# EAGLE design asynclabs_blackwidow_v1 (EAGLE 5.06)
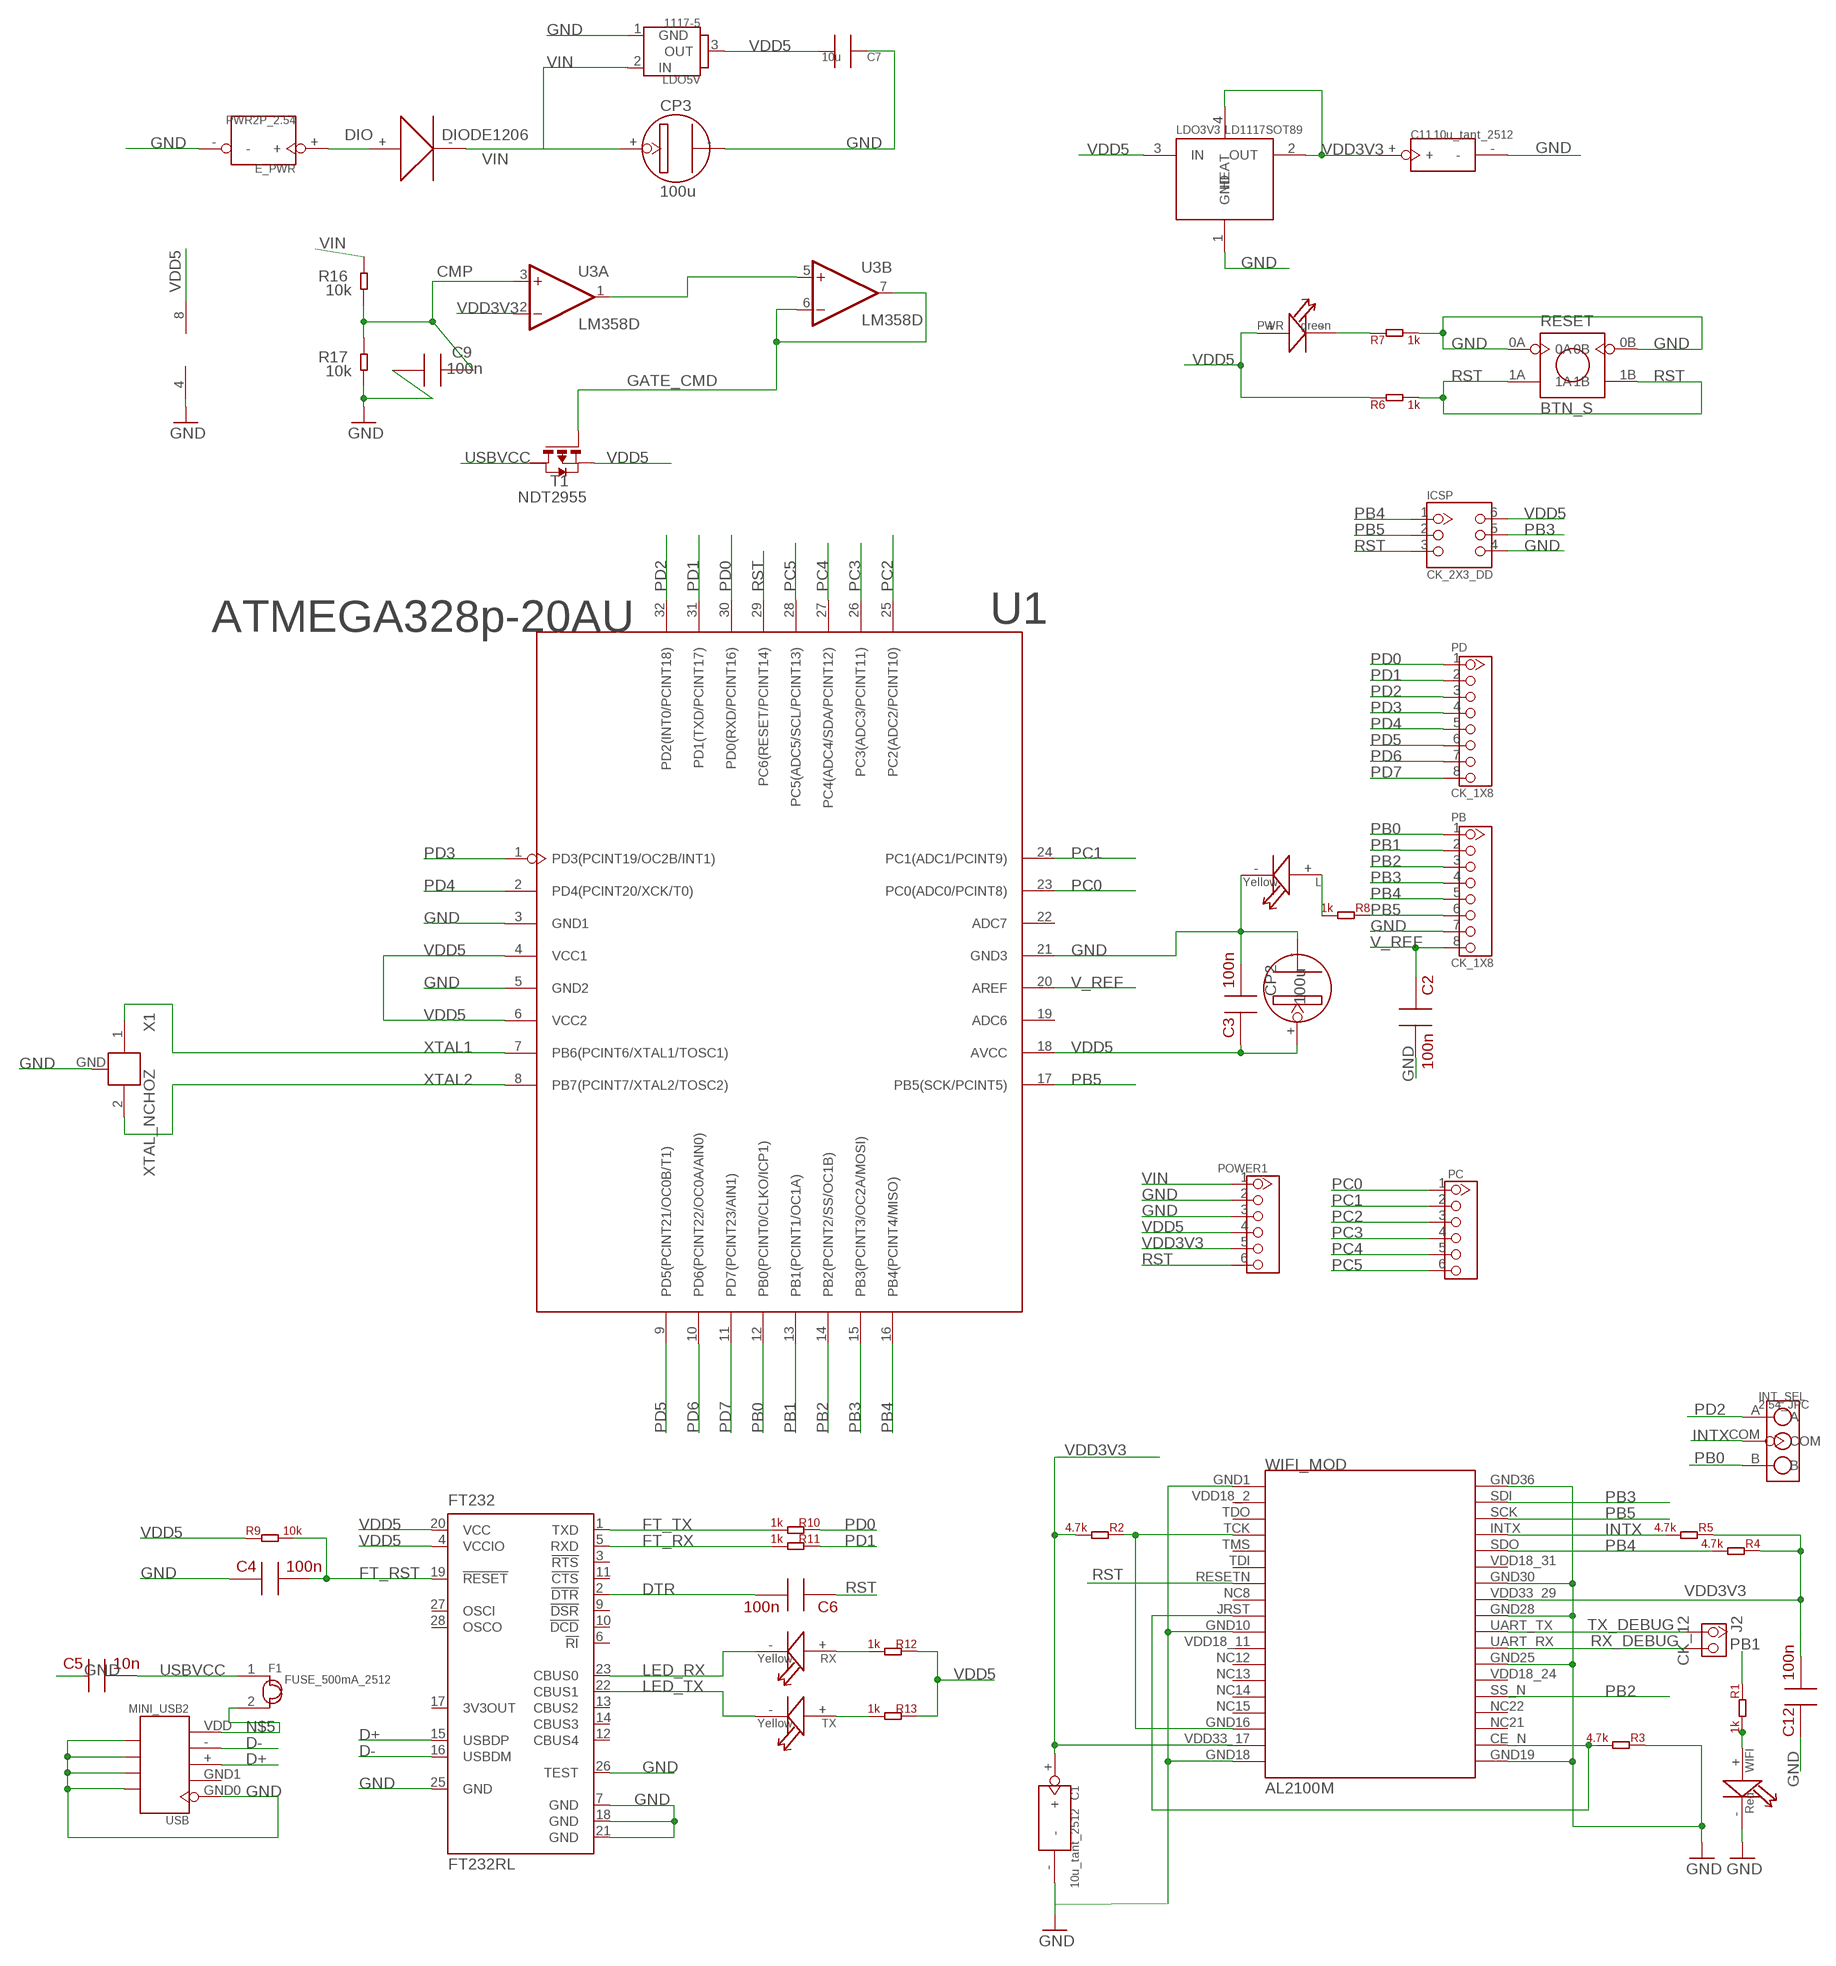
[diagram p0: schematic, sheet 1]

## Parts
C1  10u_tant_2512  C_TAN_3X3.5  [C_TAN_3X3.5]
C2  100n  C0603  [0603]
C3  100n  C0603  [0603]
C4  100n  C0603  [0603]
C5  10n  C0603  [0603]
C6  100n  C0603  [0603]
C7  10u  C0805  [0805]
C9  100n  C0603  [0603]
C11  10u_tant_2512  C_TAN_3X3.5  [C_TAN_3X3.5]
C12  100n  C0603  [0603]
CP2  100u  PANASONIC_D260  [SANYO-OSCON_SMD_C6]
CP3  100u  PANASONIC_D260  [SANYO-OSCON_SMD_C6]
DIO  DIODE1206  DIODE2010  [DIODE_2010]
E_PWR  PWR2P_2.54  [PWR_JST]
F1  FUSE_500mA_2512  FUSE_500MA2512  [2512]
FT232  FT232RL  [SSOP28]
ICSP  CK_2X3_DD  [CK_2X3]
INT_SEL  2.54_JPC  [2.54_JP_C]
J2  CK_12  [CK_1*2]
L  Yellow  LED0805  [LED0805]
LDO3V3  LD1117SOT89  [SOT89]
LDO5V  1117-5  [TO252]
PB  CK_1X8  CK_1X8DD  [CK_1X8]
PC  CK_1X6  [CK_1X6]
PD  CK_1X8  CK_1X8DD  [CK_1X8]
POWER1  CK_1X6  [CK_1X6]
PWR  green  LED0805  [LED0805]
R1  1k  R0603  [0603]
R2  4.7k  R0603  [0603]
R3  4.7k  R0603  [0603]
R4  4.7k  R0603  [0603]
R5  4.7k  R0603  [0603]
R6  1k  R0603  [0603]
R7  1k  R0603  [0603]
R8  1k  R0603  [0603]
R9  10k  R0603  [0603]
R10  1k  R0603  [0603]
R11  1k  R0603  [0603]
R12  1k  R0603  [0603]
R13  1k  R0603  [0603]
R16  10k  R0603  [0603]
R17  10k  R0603  [0603]
RESET  BTN_S  [BTN_S]
RX  Yellow  LED0805  [LED0805]
T1  NDT2955  PMOSSOT223  [SOT223]
TX  Yellow  LED0805  [LED0805]
U1  ATMEGA328p-20AU  ATMEGA168-20AU  [ATMEGA168-20AU]
U3  LM358D  [SO08]
USB  MINI_USB2  [MINI_USB2]
WIFI  Red  LED0805  [LED0805]
WIFI_MOD  AL2100M  [AL2100M]
X1  XTAL_NCHOZ  [XTAL_NC]

## Nets
CMP: C9.2 R16.1 R17.2 U3.3(A:+IN)
D+: FT232.15(USBDP) USB.+
D-: FT232.16(USBDM) USB.-
DTR: C6.2 FT232.2(!DTR)
FT_RST: C4.2 FT232.19(!RESET) R9.2
FT_RX: FT232.5(RXD) R11.2
FT_TX: FT232.1(TXD) R10.2
GATE_CMD: T1.1(G) U3.6(B:-IN) U3.7(B:OUT)
GND: C1.- C2.2 C3.2 C4.1 C5.1 C7.1 C9.1 C11.- C12.1 CP2.- CP3.- E_PWR.- FT232.7(GND) FT232.18(GND) FT232.21(GND) FT232.25(GND) FT232.26(TEST) ICSP.4 L.- LDO3V3.1(GND) LDO5V.1(GND) PB.7 POWER1.2 POWER1.3 R3.1 R7.2 R17.1 RESET.0A RESET.0B U1.3(GND1) U1.5(GND2) U1.21(GND3) U3.4(P:V-) USB.GND0 USB.P$6 USB.P$7 USB.P$8 USB.P$9 WIFI.- WIFI_MOD.GND1 WIFI_MOD.GND10 WIFI_MOD.GND18 WIFI_MOD.GND19 WIFI_MOD.GND25 WIFI_MOD.GND28 WIFI_MOD.GND30 WIFI_MOD.GND36 X1.GND
GND_TIE: R3.2 WIFI_MOD.CE_N WIFI_MOD.JRST
INTX: INT_SEL.COM R5.2 WIFI_MOD.INTX
LED_RX: FT232.23(CBUS0) RX.-
LED_TX: FT232.22(CBUS1) TX.-
N$1: DIO.+ E_PWR.+
N$3: PWR.- R7.1
N$4: L.+ R8.2
N$5: F1.2 USB.VDD
N$7: R1.2 WIFI.+
N$28: U3.1(A:OUT) U3.5(B:+IN)
N$31: R12.2 RX.+
N$32: R13.2 TX.+
PB0: INT_SEL.B PB.1 U1.12(PB0(PCINT0/CLKO/ICP1))
PB1: PB.2 R1.1 U1.13(PB1(PCINT1/OC1A))
PB2: PB.3 U1.14(PB2(PCINT2/SS/OC1B)) WIFI_MOD.SS_N
PB3: ICSP.5 PB.4 U1.15(PB3(PCINT3/OC2A/MOSI)) WIFI_MOD.SDI
PB4: ICSP.1 PB.5 R4.2 U1.16(PB4(PCINT4/MISO)) WIFI_MOD.SDO
PB5: ICSP.2 PB.6 R8.1 U1.17(PB5(SCK/PCINT5)) WIFI_MOD.SCK
PC0: PC.1 U1.23(PC0(ADC0/PCINT8))
PC1: PC.2 U1.24(PC1(ADC1/PCINT9))
PC2: PC.3 U1.25(PC2(ADC2/PCINT10))
PC3: PC.4 U1.26(PC3(ADC3/PCINT11))
PC4: PC.5 U1.27(PC4(ADC4/SDA/PCINT12))
PC5: PC.6 U1.28(PC5(ADC5/SCL/PCINT13))
PD0: PD.1 R10.1 U1.30(PD0(RXD/PCINT16))
PD1: PD.2 R11.1 U1.31(PD1(TXD/PCINT17))
PD2: INT_SEL.A PD.3 U1.32(PD2(INT0/PCINT18))
PD3: PD.4 U1.1(PD3(PCINT19/OC2B/INT1))
PD4: PD.5 U1.2(PD4(PCINT20/XCK/T0))
PD5: PD.6 U1.9(PD5(PCINT21/OC0B/T1))
PD6: PD.7 U1.10(PD6(PCINT22/OC0A/AIN0))
PD7: PD.8 U1.11(PD7(PCINT23/AIN1))
RST: C6.1 ICSP.3 POWER1.6 R6.2 RESET.1A RESET.1B U1.29(PC6(RESET/PCINT14)) WIFI_MOD.RESETN(RSTN)
RX_DEBUG: J2.2 WIFI_MOD.UART_RX
TX_DEBUG: J2.1 WIFI_MOD.UART_TX
USBVCC: C5.2 F1.1 T1.2(D)
V_REF: C2.1 PB.8 U1.20(AREF)
VDD3V3: C1.+ C11.+ C12.2 LDO3V3.2(OUT) LDO3V3.4(HEAT) POWER1.5 R2.2 R4.1 R5.1 U3.2(A:-IN) WIFI_MOD.VDD33_17 WIFI_MOD.VDD33_29
VDD5: C3.1 C7.2 CP2.+ FT232.4(VCCIO) FT232.20(VCC) ICSP.6 LDO3V3.3(IN) LDO5V.3(OUT) POWER1.4 PWR.+ R6.1 R9.1 R12.1 R13.1 T1.3(S) U1.4(VCC1) U1.6(VCC2) U1.18(AVCC) U3.8(P:V+)
VDD_TIE: R2.1 WIFI_MOD.GND16 WIFI_MOD.TCK
VIN: CP3.+ DIO.- LDO5V.2(IN) POWER1.1 R16.2
XTAL1: U1.7(PB6(PCINT6/XTAL1/TOSC1)) X1.1
XTAL2: U1.8(PB7(PCINT7/XTAL2/TOSC2)) X1.2
Unconnected: FT232.3(!RTS) FT232.6(!RI) FT232.9(!DSR) FT232.10(!DCD) FT232.11(!CTS) FT232.12(CBUS4) FT232.13(CBUS2) FT232.14(CBUS3) FT232.17(3V3OUT) FT232.27(OSCI) FT232.28(OSCO) T1.4(D2) U1.19(ADC6) U1.22(ADC7) USB.GND1 WIFI_MOD.NC8 WIFI_MOD.NC12 WIFI_MOD.NC13 WIFI_MOD.NC14 WIFI_MOD.NC15 WIFI_MOD.NC21 WIFI_MOD.NC22 WIFI_MOD.TDI WIFI_MOD.TDO WIFI_MOD.TMS WIFI_MOD.VDD18_2 WIFI_MOD.VDD18_11 WIFI_MOD.VDD18_24 WIFI_MOD.VDD18_31

## Library data of the parts
C1 C11 = CPT_SMD:C_TAN
C2-C6 C9 C12 = CPT_SMD:C0603; C0603: 100N
C7 = CPT_SMD:C0805
CP2 CP3 = CPT_SMD:PANASONIC_D
DIO = CPT_SMD:DIODE
E_PWR = CONNECTER:PWR2P_2.54
F1 = CPT_SMD:FUSE_500MA
FT232 = IC_SMD:FT232R: Source: http://www.ftdichip.com/Documents/DataSheets/DS_FT232R_v104.pdf
ICSP = CONNECTER:CK_2X3
INT_SEL = CPT_CJ:2.54_JP
J2 = CONNECTER:CK_1*2
L PWR RX TX WIFI = CPT_SMD:LED0805
LDO3V3 = ICs:LD1117
LDO5V = ICs_v54:1117-5
PB PD = CONNECTER:CK_1X8
PC POWER1 = CONNECTER:CK_1X6
R1-R13 R16 R17 = CPT_SMD:R0603
RESET = CPT_SMD:BTN_S
T1 = zetex:PMOSSOT223: MOS FET
U1 = IC_SMD:ATMEGA168-20AU
U3 = linear:LM358: OP AMP also LM158; LM258; LM2904 Source: http://cache.national.com/ds/LM/LM158.pdf
USB = CONNECTER:MINI_USB2
WIFI_MOD = EXT_moudle:AL2100M
X1 = CPT_SMD:XTAL_NC

## Net classes
0 default: width 0.254 mm, drill 0.305 mm, clearance 0.203 mm
1 power: width 0.254 mm, drill 0.305 mm, clearance 0.203 mm
2 gnd: width 0.254 mm, drill 0.305 mm, clearance 0.203 mm
3 usbvcc: width 0.254 mm, drill 0.305 mm, clearance 0.203 mm

## Board
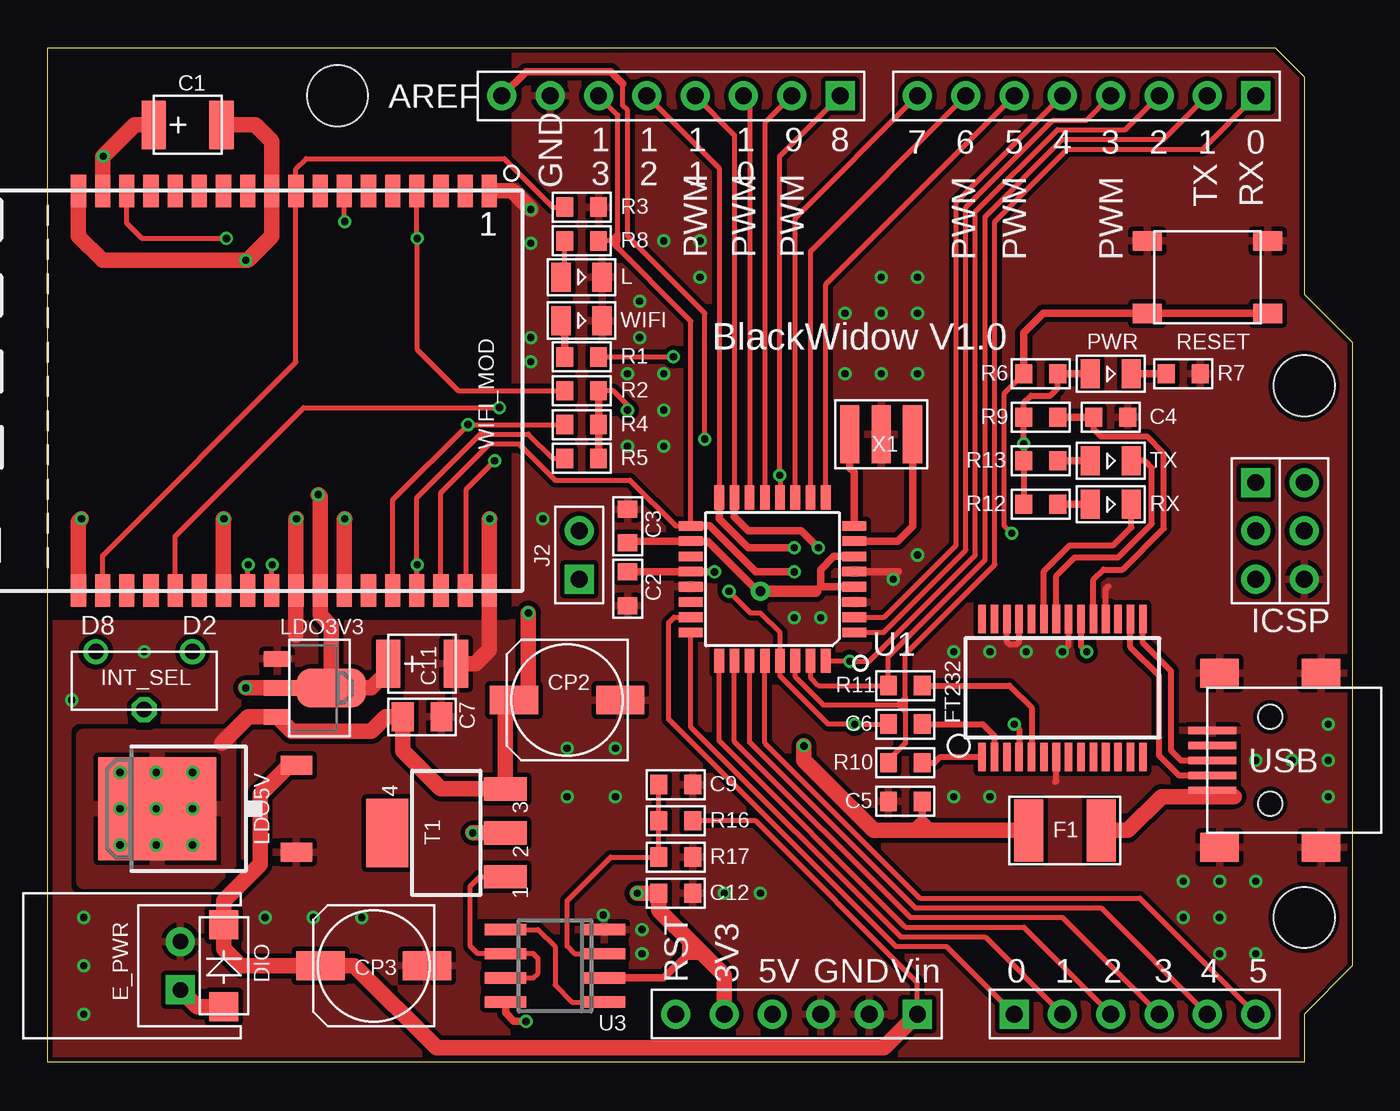
[diagram p1: board, top side]
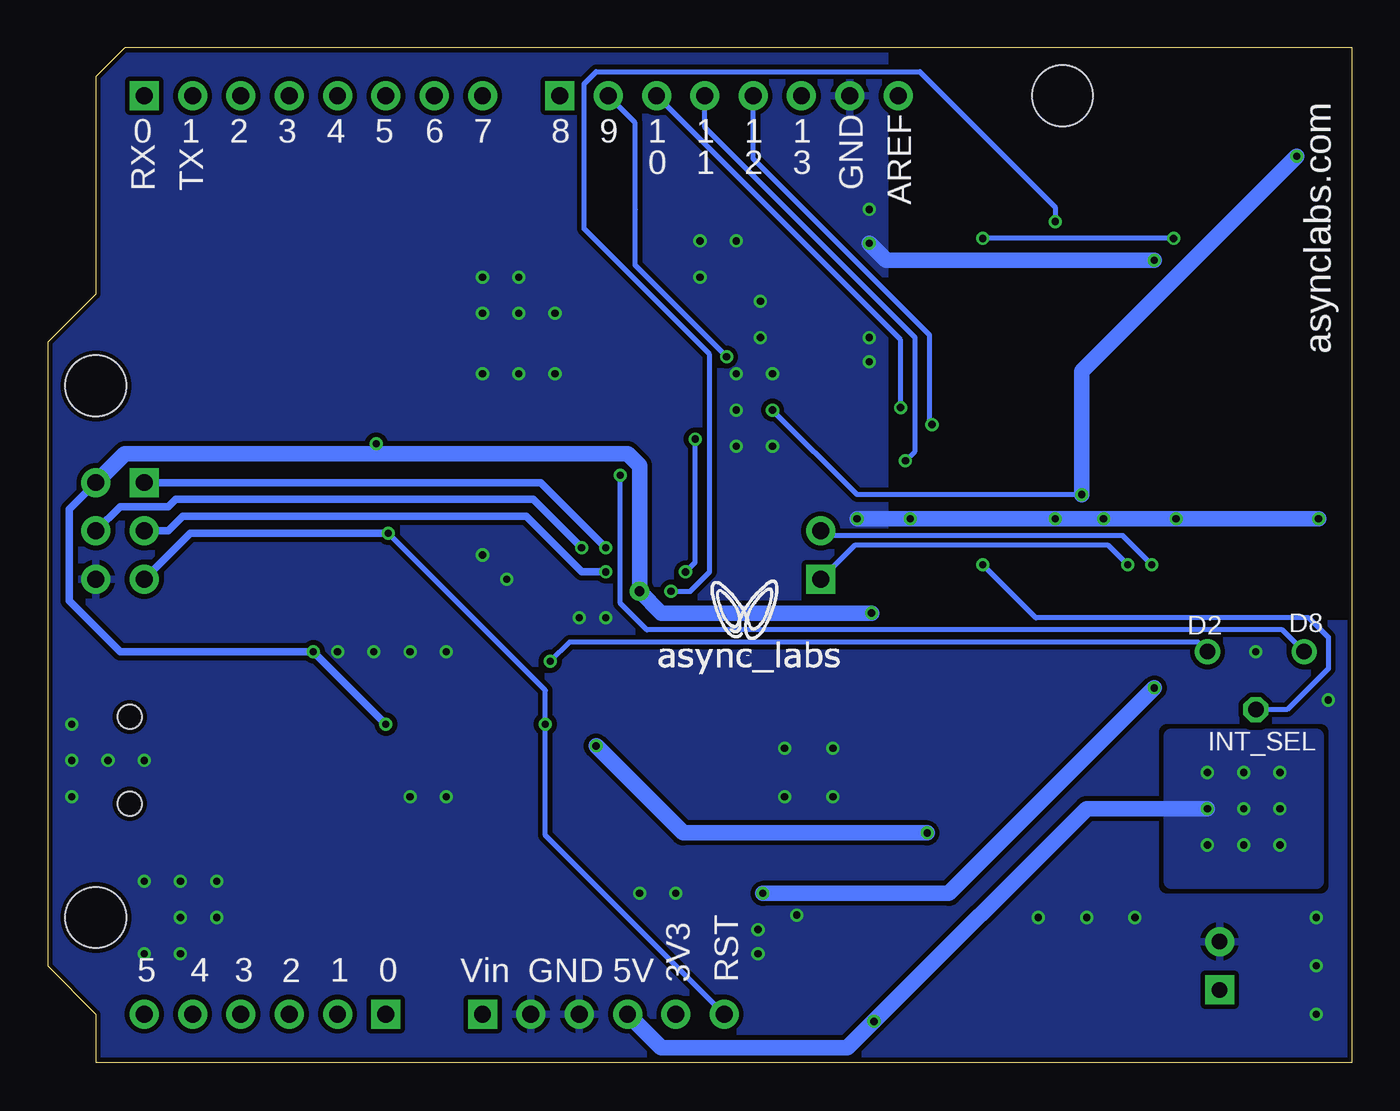
[diagram p2: board, bottom side, seen from below]

Size 68.58 x 53.34 mm. Coordinates in mm from the lower left corner, seen from the top.
Outline: 0,0 0,53.34 64.52,53.34 66.04,51.82 66.04,40.39 68.58,37.85 68.58,5.08 66.04,2.54 66.04,0 0,0
Copper layers (1*16): Top 0.035mm / dielectric 1.5mm / Bottom 0.035mm
Design rules "SeeedStudio_rule_no_angle_090911": minimum track width 0.0025mm, minimum drill 10mil, track to track 6mil, track to pad 6mil, pad to pad 6mil, via to via 6mil, smd to smd 0mil, copper to edge 10mil, drill to drill 10mil, minimum pad ring 10mil, minimum via ring 6mil, stop-mask expansion 2mil, vias tented up to drill 100mil, thermal gap 10mil
Holes 3.2 mm at 15.24,50.8 66.04,35.56 66.04,7.62
tRestrict: area 0,23.5 to 24.1,53.3; area 50.2,22.5 to 51.3,24.1; area 55.4,22.5 to 55.9,24.1; area 53.5,22.5 to 53.8,24.1; area 52.8,15.4 to 53.2,16.8
bRestrict: area 0,23.5 to 24.1,53.3

### Footprints (pad centres in the part's own frame; a part is rotated, then mirrored left to right if it is on the bottom)
C_TAN_3X3.5 = smd 2.54 x 1.27: + 0,1.778; - 0,-1.778
0603 = smd 0.889 x 1.016: 1 -0.889,0; 2 0.889,0
0805 = smd 1.143 x 1.524: 1 -1.016,0; 2 1.016,0
SANYO-OSCON_SMD_C6 = smd 2.54 x 1.524: + 2.794,0; - -2.794,0
DIODE_2010 = smd 1.524 x 1.524: + 0,-2.159; - 0,2.159
PWR_JST = drill 0.813 pad 1.524 square: + 0,-1.27 | drill 0.813 pad 1.524 round: - 0,1.27
2512 = smd 1.524 x 3.302: 1 -1.905,0; 2 1.905,0
SSOP28 = smd 0.4 x 1.5: 1 -4.225,-3.625; 2 -3.575,-3.625; 3 -2.925,-3.625; 4 -2.275,-3.625; 5 -1.625,-3.625; 6 -0.975,-3.625; 7 -0.325,-3.625; 8 0.325,-3.625; 9 0.975,-3.625; 10 1.625,-3.625; 11 2.275,-3.625; 12 2.925,-3.625; 13 3.575,-3.625; 14 4.225,-3.625; 15 4.225,3.625; 16 3.575,3.625; 17 2.925,3.625; 18 2.275,3.625; 19 1.625,3.625; 20 0.975,3.625; 21 0.325,3.625; 22 -0.325,3.625; 23 -0.975,3.625; 24 -1.625,3.625; 25 -2.275,3.625; 26 -2.925,3.625; 27 -3.575,3.625; 28 -4.225,3.625
CK_2X3 = drill 0.889 pad 1.524 square: 1 -1.27,2.54 | drill 0.889 pad 1.524 round: 2 -1.27,0; 3 -1.27,-2.54; 4 1.27,-2.54; 5 1.27,0; 6 1.27,2.54
2.54_JP_C = drill 0.813 round: A -1.27,2.54; B -1.27,-2.54 | drill 0.813 octagon: COM 1.778,0
CK_1*2 = drill 0.889 pad 1.524 square: 1 0,1.27 | drill 0.889 pad 1.524 round: 2 0,-1.27
LED0805 = smd 1.016 x 1.524: + -1.077,0; - 1.077,0
SOT89 = smd 0.8 x 1.4: 1 -1.524,-1.905; 3 1.524,-1.905 | smd 0.8 x 1.9: 2 0,-1.651 | smd 2.032 x 3.65: 4 0,0.94
TO252 = smd 1.016 x 1.651: 1 -2.286,-4.826; 2 2.286,-4.826 | smd 5.4 x 6.2: 3 0,2.5
CK_1X8 = drill 0.889 pad 1.524 square: 1 0,8.89 | drill 0.889 pad 1.524 round: 2 0,6.35; 3 0,3.81; 4 0,1.27; 5 0,-1.27; 6 0,-3.81; 7 0,-6.35; 8 0,-8.89
CK_1X6 = drill 0.889 pad 1.524 square: 1 0,6.35 | drill 0.889 pad 1.524 round: 2 0,3.81; 3 0,1.27; 4 0,-1.27; 5 0,-3.81; 6 0,-6.35
BTN_S = smd 1.524 x 1.016: 0A -3.175,1.905; 0B 3.175,1.905; 1A -3.175,-1.905; 1B 3.175,-1.905
SOT223 = smd 1.219 x 2.235: 1 -2.311,-3.099; 2 0,-3.099; 3 2.311,-3.099 | smd 3.6 x 2.2: 4 0,3.099
ATMEGA168-20AU = smd 1.27 x 0.508: 1 -4.293,2.8; 2 -4.293,2; 3 -4.293,1.2; 4 -4.293,0.4; 5 -4.293,-0.4; 6 -4.293,-1.2; 7 -4.293,-2; 8 -4.293,-2.8; 17 4.293,-2.8; 18 4.293,-2; 19 4.293,-1.2; 20 4.293,-0.4; 21 4.293,0.4; 22 4.293,1.2; 23 4.293,2; 24 4.293,2.8 | smd 0.508 x 1.27: 9 -2.8,-4.293; 10 -2,-4.293; 11 -1.2,-4.293; 12 -0.4,-4.293; 13 0.4,-4.293; 14 1.2,-4.293; 15 2,-4.293; 16 2.8,-4.293; 25 2.8,4.293; 26 2,4.293; 27 1.2,4.293; 28 0.4,4.293; 29 -0.4,4.293; 30 -1.2,4.293; 31 -2,4.293; 32 -2.8,4.293
SO08 = smd 0.6 x 2.2: 1 -1.905,-2.6; 2 -0.635,-2.6; 3 0.635,-2.6; 4 1.905,-2.6; 5 1.905,2.6; 6 0.635,2.6; 7 -0.635,2.6; 8 -1.905,2.6
MINI_USB2 = smd 2.54 x 0.381: + -2.286,0; - -2.286,-0.787; GND0 -2.286,1.575; GND1 -2.286,0.787; VDD -2.286,-1.575 | smd 2.032 x 1.524: P$6 -1.905,4.572; P$7 -1.905,-4.572; P$8 3.429,4.572; P$9 3.429,-4.572 | hole 1.27: 0.762,2.286; 0.762,-2.286
AL2100M = smd 0.8 x 1.7: CE_N 6.63,10.12; GND1 -13.69,-10.88; GND10 -2.26,-10.88; GND16 5.36,-10.88; GND18 7.9,-10.88; GND19 7.9,10.12; GND25 0.28,10.12; GND28 -3.53,10.12; GND30 -6.07,10.12; GND36 -13.69,10.12; INTX -9.88,10.12; JRST -3.53,-10.88; NC8 -4.8,-10.88; NC12 0.28,-10.88; NC13 1.55,-10.88; NC14 2.82,-10.88; NC15 4.09,-10.88; NC21 5.36,10.12; NC22 4.09,10.12; RESETN -6.07,-10.88; SCK -11.15,10.12; SDI -12.42,10.12; SDO -8.61,10.12; SS_N 2.82,10.12; TCK -9.88,-10.88; TDI -7.34,-10.88; TDO -11.15,-10.88; TMS -8.61,-10.88; UART_RX -0.99,10.12; UART_TX -2.26,10.12; VDD18_2 -12.42,-10.88; VDD18_11 -0.99,-10.88; VDD18_24 1.55,10.12; VDD18_31 -7.34,10.12; VDD33_17 6.63,-10.88; VDD33_29 -4.8,10.12
XTAL_NC = smd 1.016 x 3.048: 1 -1.651,0; 2 1.651,0; GND 0,0

### Placement (x,y rotation side)
C1  7.37,49.28 90 top
C2  30.48,24.89 270 top
C3  30.48,28.19 90 top
C4  55.88,33.91 180 top
C5  45.09,13.72 0 top
C6  45.09,17.78 0 top
C7  19.68,18.16 180 top
C9  33.02,14.61 180 top
C11  19.68,20.95 90 top
C12  33.02,8.89 180 top
CP2  27.3,19.05 180 top
CP3  17.14,5.08 180 top
DIO  9.27,5.08 0 top
E_PWR  6.99,5.08 0 top
F1  53.47,12.19 0 top
FT232  53.34,19.68 0 top
ICSP  64.77,27.94 0 top
INT_SEL  5.08,20.32 270 top
J2  27.94,26.67 180 top
L  28.07,41.27 0 top
LDO3V3  13.97,19.68 270 top
LDO5V  8.26,13.34 90 top
PB  32.77,50.8 270 top
PC  57.15,2.54 90 top
PD  54.61,50.8 270 top
POWER1  39.37,2.54 270 top
PWR  55.88,36.2 0 top
R1  28.07,37.08 180 top
R2  28.07,35.31 0 top
R3  28.07,44.96 180 top
R4  28.07,33.53 180 top
R5  28.07,31.75 180 top
R6  52.2,36.2 180 top
R7  59.69,36.2 0 top
R8  28.07,43.18 180 top
R9  52.2,33.91 0 top
R10  45.09,15.75 0 top
R11  45.09,19.81 0 top
R12  52.2,29.34 0 top
R13  52.2,31.62 0 top
R16  33.02,12.7 0 top
R17  33.02,10.79 180 top
RESET  60.96,41.27 0 top
RX  55.88,29.34 0 top
T1  20.95,12.06 90 top
TX  55.88,31.62 0 top
U1  38.1,25.4 180 top
U3  26.67,5.08 90 top
USB  63.5,15.88 0 top
WIFI  28.07,38.99 0 top
WIFI_MOD  9.53,34.92 180 top
X1  43.81,33.02 180 top

### Tracks (layer width: path | path; a pad name or v marks a point on that pad's centre or on a via)
CMP
  Top 0.254: C9.2 R16.1 R17.2 29.59,10.79 27.3,8.51 27.3,6.1 27.69,5.71 U3.3
D+
  Top 0.305: FT232.15 57.56,22.06 59.05,20.57 59.05,16.38 59.56,15.88 USB.+
D-
  Top 0.305: FT232.16 56.91,21.82 58.42,20.32 58.42,16.13 59.46,15.09 USB.-
DTR
  Top 0.305: FT232.2 49.77,17.16 49.15,17.78 C6.2
FT_RST
  Top 0.305: C4.2 54.99,33.27 55.37,32.89 57.78,32.89 58.67,32 58.67,28.07 56.52,25.91 55.5,25.91 54.97,25.37 FT232.19
  Top 0.406: C4.2 R9.2
FT_RX
  Top 0.305: FT232.5 51.72,18.64 50.55,19.81 R11.2
FT_TX
  Top 0.305: FT232.1 46.92,16.06 46.61,15.75 R10.2
GATE_CMD
  Top 0.254: U3.7 25.53,4.45 25.78,4.7 25.78,5.46 25.53,5.71 U3.6 22.61,5.71 22.23,6.1 22.23,9.27 22.71,9.75 T1.1
GND  (via drill 0.38)
  Top 0.305: FT232.26 50.41,22.1 50.55,21.97 50.93,21.97 51.06,22.11 FT232.25 | FT232.7 53.02,14.79 52.96,14.73 | FT232.21 53.66,21.91 v53.34,21.59 | FT232.18 55.62,24.88 55.75,25.02
  Top 0.406: U1.5 44.69,25.8 44.7,25.78
  Top 0.813: WIFI_MOD.GND19 1.62,28.42 v1.78,28.57 | WIFI_MOD.GND25 9.24,28.55 v9.27,28.57 | v23.24,28.57 23.21,28.55 WIFI_MOD.GND36 23.21,21.69 22.48,20.95 C11.- | v13.08,28.57 13.05,28.55 WIFI_MOD.GND28 13.05,22.45 | WIFI_MOD.GND30 15.6,28.55 v15.62,28.57 | LDO3V3.1 12.45,21.21 | C1.- 10.92,49.28 11.79,48.41 WIFI_MOD.GND10 11.79,43.43 10.52,42.16 v10.41,42.16 2.9,42.16 1.62,43.43 WIFI_MOD.GND18 | WIFI_MOD.GND1 24.43,45.8 v25.4,44.83
  Bottom 0.813: v1.78,28.57 v9.27,28.57 v13.08,28.57 v15.62,28.57 v23.24,28.57 v26.04,28.57 | v10.41,42.16 24.51,42.16 v25.4,43.05
  other vias: 44.45,25.4 39.24,23.37 32.38,36.2 30.48,36.2 31.11,38.1 31.11,40.01 32.38,34.29 30.48,32.38 47.62,13.97 49.53,13.97 63.5,15.88 65.41,15.88 67.31,15.88 67.31,17.78 67.31,13.97 59.69,9.53 59.69,7.62 61.59,7.62 61.59,9.53 63.5,9.53 61.59,5.71 63.5,5.71 34.29,41.27 34.29,43.18 32.38,43.18 40.64,23.37 25.4,38.1 25.4,36.83 45.72,26.67 47.62,21.59 49.53,21.59 51.44,21.59 32.38,32.38 41.91,36.2 43.81,36.2 45.72,36.2 45.72,39.37 43.81,39.37 41.91,39.37 45.72,41.27 43.81,41.27 1.91,7.62 5.08,21.59 1.27,19.05 1.91,5.08 1.91,2.54 11.43,7.62 13.97,7.62 16.51,7.62 31.24,6.99 35.56,8.89 37.47,8.89 29.21,7.75 31.24,5.71 27.3,16.51 27.3,13.97 29.84,13.97 29.84,16.51
  pour Bottom: -6.35,53.34 -4.45,53.34 -4.45,52.07 -6.35,52.07
  pour Top (isolate 0.254, rank 6): 0,53.34 64.77,53.34 66.04,52.07 66.04,40.39 68.58,37.85 68.58,5.08 66.04,2.54 66.04,0 0,0
  pour Bottom (isolate 0.254, rank 6): 0,53.34 64.77,53.34 66.04,52.07 66.04,40.39 68.58,37.85 68.58,5.08 66.04,2.54 66.04,0 0,0
GND_TIE
  Top 0.254: R3.2 26.54,44.96 24,47.5 13.59,47.5 13.05,46.96 WIFI_MOD.JRST 13.05,36.8 2.9,26.64 WIFI_MOD.CE_N
INTX  (via drill 0.38)
  Top 0.254: v19.43,26.16 19.41,26.14 WIFI_MOD.INTX 19.41,29.69 22.73,33.02 25.27,33.02 26.54,31.75 R5.2
  Bottom 0.254: INT_SEL.COM 3.43,18.54 1.27,20.7 1.27,22.35 2.29,23.37 16.64,23.37 v19.43,26.16
LED_RX
  Top 0.305: RX.- 56.96,28.13 56.01,27.18 53.72,27.18 52.37,25.82 FT232.23
LED_TX
  Top 0.305: TX.- 57.66,31.62 58.04,31.24 58.04,28.32 56.26,26.54 53.98,26.54 53.02,25.58 FT232.22
N$1
  Top 0.813: DIO.+ 7.87,2.92 E_PWR.+
N$3
  Top 0.406: PWR.- R7.1
N$4
  Top 0.254: R8.2 27.18,41.46 L.+
N$5
  Top 0.305: 61.21,13.97 USB.VDD
  Top 0.813: 62.36,13.97 61.21,13.97 58.55,13.97 56.77,12.19 F1.2
N$7
  Top 0.406: R1.2 27.18,38.8 WIFI.+
N$28
  Top 0.254: U3.1 27.56,3.17 26.67,4.06 26.67,6.1 25.78,6.99 U3.5
N$31
  Top 0.406: R12.2 RX.+
N$32
  Top 0.406: R13.2 TX.+
PB0  (via drill 0.38)
  Top 0.254: 38.54,47.69 38.5,47.64 | 38.54,47.69 PB.1 | U1.12 38.5,30.84 v38.48,30.86 38.48,47.62 38.54,47.69
  Bottom 0.254: v38.48,30.86 38.48,24.13 37.08,22.73 3.68,22.73 INT_SEL.B
PB1  (via drill 0.38)
  Top 0.254: U1.13 37.7,49.38 PB.2 | R1.1 v32.89,37.08
  Bottom 0.254: 37.7,44.83 37.7,49.38 PB.2 | 37.7,44.83 37.7,44.81 | v32.89,37.08 32.89,37.1 37.7,41.91 37.7,44.83
PB2  (via drill 0.38)
  Top 0.254: U1.14 36.9,50.48 PB.3 | WIFI_MOD.SS_N 6.71,27.66 13.46,34.42 v23.75,34.42
  Bottom 0.254: v23.75,34.42 23.75,37.97 PB.3
PB3  (via drill 0.38)
  Top 0.254: U1.15 36.1,48.74 PB.4 | 22.01,24.8 22.01,30.14 v23.5,31.62
  Top 0.406: U1.15 36.1,28.67 36.83,27.94 39.62,27.94 v40.51,27.05 | WIFI_MOD.SDI 22.01,24.8
  Bottom 0.254: PB.4 34.04,49.15 22.99,38.1 22.99,32.13 v23.5,31.62
  Bottom 0.406: ICSP.5 64.77,29.21 62.23,29.21 61.85,29.59 43.05,29.59 v40.51,27.05
PB4  (via drill 0.38)
  Top 0.254: U1.16 35.3,47 PB.5 | R4.2 v22.1,33.53 18.14,29.57 WIFI_MOD.SDO
  Top 0.406: U1.16 35.3,28.58 36.83,27.05 v39.24,27.05
  Bottom 0.254: PB.5 31.5,47.5 22.23,38.23 22.23,33.66 v22.1,33.53
  Bottom 0.406: v39.24,27.05 42.67,30.48 ICSP.1
PB5  (via drill 0.38)
  Top 0.254: 29.59,43.18 33.81,38.96 U1.17 33.01,28.2 30.61,30.61 26.67,30.61 24.77,32.51 23.24,32.51 20.68,29.95 WIFI_MOD.SCK | 29.59,43.18 R8.1 | PB.6 29.97,49.78 29.97,42.8 29.84,42.93 29.84,43.18 29.97,43.18 29.97,43.56 29.59,43.18
  Top 0.406: U1.17 34.79,28.2 37.21,25.78 v39.24,25.78
  Bottom 0.406: v39.24,25.78 40.51,25.78 43.43,28.7 61.47,28.7 62.23,27.94 ICSP.2
PC0
  Top 0.254: U1.23 32.92,23.4 32.64,23.11 32.64,18.03 44.58,6.1 47.24,6.1 PC.1
PC1
  Top 0.254: U1.24 33.81,17.63 44.83,6.6 49.28,6.6 PC.2
PC2
  Top 0.254: U1.25 35.3,16.9 45.09,7.11 51.31,7.11 PC.3
PC3
  Top 0.254: U1.26 36.1,16.86 45.34,7.62 53.34,7.62 PC.4
PC4
  Top 0.254: U1.27 36.9,16.82 45.59,8.13 55.37,8.13 PC.5
PC5
  Top 0.254: U1.28 37.7,16.78 45.85,8.64 57.4,8.64 PC.6
PD0
  Top 0.254: PD.1 60.71,48.01 53.59,48.01 49.78,44.2 49.78,26.16 45.09,21.46 45.09,19.18 | U1.30 39.3,20.26 40.77,18.8 44.7,18.8 | 44.7,18.8 45.09,18.41 | 45.09,18.41 45.09,18.29 | 45.09,18.41 45.09,18.8 44.7,18.8 | 44.7,18.8 45.09,19.18 | R10.1 44.2,15.88 45.09,16.76 45.09,19.18
PD1
  Top 0.254: PD.2 58.67,48.51 53.34,48.51 49.28,44.45 49.28,26.42 44.2,21.34 R11.1 40.51,19.81 40.1,20.23 U1.31
PD2  (via drill 0.38)
  Top 0.254: PD.3 56.64,49.02 53.09,49.02 48.77,44.7 48.77,26.67 43.18,21.08 v42.16,21.08 40.92,21.08 U1.32
  Bottom 0.254: v42.16,21.08 41.15,22.1 8.13,22.1 INT_SEL.A
PD3
  Top 0.254: U1.1 43.94,22.6 48.26,26.92 48.26,44.96 52.83,49.53 54.61,49.53 PD.4
PD4
  Top 0.254: U1.2 43.97,23.4 47.75,27.18 47.75,45.21 PD.5
PD5
  Top 0.254: U1.9 40.9,40.9 PD.6
PD6
  Top 0.254: U1.10 40.1,42.64 PD.7
PD7
  Top 0.254: U1.11 39.3,44.38 PD.8
RST  (via drill 0.38)
  Top 0.254: C6.1 v42.42,17.78 41.02,17.78 38.5,20.3 U1.29 38.5,22.59 37.47,23.62 36.96,23.62 v35.81,24.77 | R6.2 50.29,35.18 50.29,28.19 v50.67,27.81 | WIFI_MOD.RESETN 15.6,44.22 v15.62,44.2
  Top 0.406: R6.2 51.31,38.35 52.32,39.37 RESET.1A RESET.1B
  Bottom 0.254: v15.62,44.2 15.62,44.96 22.73,52.07 39.75,52.07 40.39,51.44 40.39,43.81 33.78,37.21 33.78,25.78 34.8,24.77 v35.81,24.77 | v50.67,27.81 42.42,19.56 v42.42,17.78 42.42,11.94 POWER1.6
  Bottom 0.406: ICSP.3 61.09,27.81 v50.67,27.81
RX_DEBUG  (via drill 0.38)
  Top 0.254: WIFI_MOD.UART_RX 10.52,26.14 v10.54,26.16
  Bottom 0.254: J2.2 27.69,27.69 12.06,27.69 v10.54,26.16
TX_DEBUG  (via drill 0.38)
  Top 0.254: WIFI_MOD.UART_TX 11.79,26.14 v11.81,26.16
  Bottom 0.254: J2.1 26.16,27.18 12.83,27.18 v11.81,26.16
USBVCC  (via drill 0.38)
  Top 0.406: 45.97,12.19 45.34,12.19 | 45.34,12.19 45.21,12.19 | 45.34,12.19 45.97,12.83 | 45.97,12.19 45.97,12.83 | 45.97,12.19 46.61,12.19 | 46.61,12.19 46.99,12.19 | 45.97,12.83 46.61,12.19 | 45.97,12.83 C5.2
  Top 0.813: F1.1 45.97,12.19 43.43,12.19 39.75,15.88 v39.75,16.64 | v22.35,12.06 T1.2
  Bottom 0.813: v22.35,12.06 35.18,12.06 v39.75,16.64
V_REF  (via drill 0.38)
  Top 0.254: v34.54,32.77 34.54,39.37 30.48,43.43 30.48,50.04 30.23,50.29 30.23,51.44
  Top 0.406: PB.8 25.15,52.07 29.59,52.07 30.23,51.44 | C2.1 30.5,25.8 U1.20 35.03,25.8 v35.05,25.78
  Bottom 0.254: v34.54,32.77 34.54,26.29 v35.05,25.78
VDD3V3  (via drill 0.38)
  Top 0.254: R2.2 29.72,35.31 30.48,34.54 v30.48,34.29
  Top 0.406: R5.1 R4.1 R2.2 | U3.2 32.38,4.45 33.53,5.59 | 34.04,6.1 33.53,6.6 33.53,5.59 | 34.04,6.1 33.53,5.59 | 34.04,6.1 34.54,5.59 | 34.54,5.59 34.8,5.33 | 33.53,5.59 34.54,5.59
  Top 0.813: LDO3V3.4 17.02,19.68 17.91,20.57 C11.+ | LDO3V3.4 LDO3V3.2 v10.41,19.68 | v14.22,29.84 14.32,29.74 WIFI_MOD.VDD33_29 14.32,23.52 14.91,22.94 LDO3V3.4 | v30.99,8.89 C12.2 32.13,8 34.04,6.1 35.56,4.57 POWER1.5 | C1.+ 4.57,49.28 v2.92,47.62 2.9,47.6 WIFI_MOD.VDD33_17
  Bottom 0.254: v30.48,34.29 26.04,29.84 v14.22,29.84
  Bottom 0.813: v14.22,29.84 14.22,36.32 v2.92,47.62 | v30.99,8.89 21.21,8.89 v10.41,19.68
VDD5  (via drill 0.38, 0.51 pad 1.02)
  Top 0.305: R12.1 R13.1 v51.31,32.51 R9.1 51.31,34.67 51.69,35.05 52.7,35.05 53.09,35.43 R6.1 | FT232.20 54.31,21.89 v54.61,21.59 | FT232.4 51.06,17.52 v50.8,17.78
  Top 0.406: C3.1 30.57,27.4 U1.18 34.7,27.4 37.34,24.77 v37.47,24.77 | R6.1 PWR.+ | U1.4 40.62,25 40.51,24.89 | 40.39,24.77 40.51,24.89 | U1.6 41.33,26.6 40.64,25.91 40.64,25.02 40.51,24.89 | U3.8 24.07,2.6 24.51,2.16 v25.15,2.16
  Top 0.61: v37.47,24.77 40.39,24.77
  Top 0.813: v25.27,23.62 25.27,19.18 25.15,19.05 CP2.+ 24.05,18.59 T1.3 20.68,14.38 18.67,16.38 C7.2 17.78,18.16 17.02,17.4 12.83,17.4 LDO3V3.3 10.54,18.16 9.14,16.76
  Bottom 0.305: 51.31,32 v51.31,32.51
  Bottom 0.406: ICSP.6 67.44,29.08 67.44,24.26 64.77,21.59 v54.61,21.59 v50.8,17.78
  Bottom 0.813: ICSP.6 64.52,32 51.31,32 38.1,32 37.47,31.37 v37.47,24.77 36.32,23.62 v25.27,23.62 | POWER1.4 36.32,0.76 26.54,0.76 v25.15,2.16 13.97,13.34 v7.62,13.34
  other vias: 5.71,13.34 3.81,13.34 7.62,15.24 5.71,15.24 3.81,15.24 3.81,11.43 5.71,11.43 7.62,11.43
  pour Top (isolate 0.406): 1.91,17.14 9.53,17.14 9.53,9.53 1.91,9.53
  pour Bottom (isolate 0.406): 1.91,17.14 9.53,17.14 9.53,9.53 1.91,9.53
VDD_TIE  (via drill 0.38)
  Top 0.254: R2.1 21.59,35.31 19.41,37.49 19.41,43.31 | 19.41,43.31 WIFI_MOD.TCK | WIFI_MOD.GND16 4.17,44.09 4.95,43.31 v9.4,43.31 | v19.43,43.31 19.41,43.31
  Bottom 0.254: v9.4,43.31 v19.43,43.31
VIN
  Top 0.254: R16.2 37.21,12.7 45.72,4.19 POWER1.1
  Top 0.813: POWER1.1 43.94,0.76 20.45,0.76 16.13,5.08 CP3.+ 10.16,5.08 9.27,5.97 DIO.- 9.27,8.51 11.18,10.41 11.18,14.1 12.7,15.62 LDO5V.2
XTAL1
  Top 0.406: U1.7 44.67,27.4 45.47,28.19 X1.1
XTAL2
  Top 0.406: U1.8 42.39,31.01 42.16,31.24 X1.2

### Text on the board
tPlace: AREF | 1 | 1 | 1 | 1 | 9 | 8 | 7 | 6 | 5 | 4 | 3 | 2 | 1 | 0 | GND | 3 | 2 | 1 | 0 | TX | RX | PWM | PWM | PWM | PWM | PWM | PWM | BlackWidow V1.0 | RST | 3V3 | 5V | GND | Vin | 0 | 1 | 2 | 3 | 4 | 5
bPlace: asynclabs.com | AREF | GND | 1 | 1 | 1 | 1 | 9 | 8 | 7 | 6 | 5 | 4 | 3 | 2 | 1 | 0 | 3 | 2 | 1 | 0 | TX | RX | RST | 3V3 | 5V | GND | Vin | 0 | 1 | 2 | 3 | 4 | 5
tNames: D8 | D2
bNames: D8 | D2 | INT_SEL